# Altium schematic sheet TopLevel.SchDoc
size A4
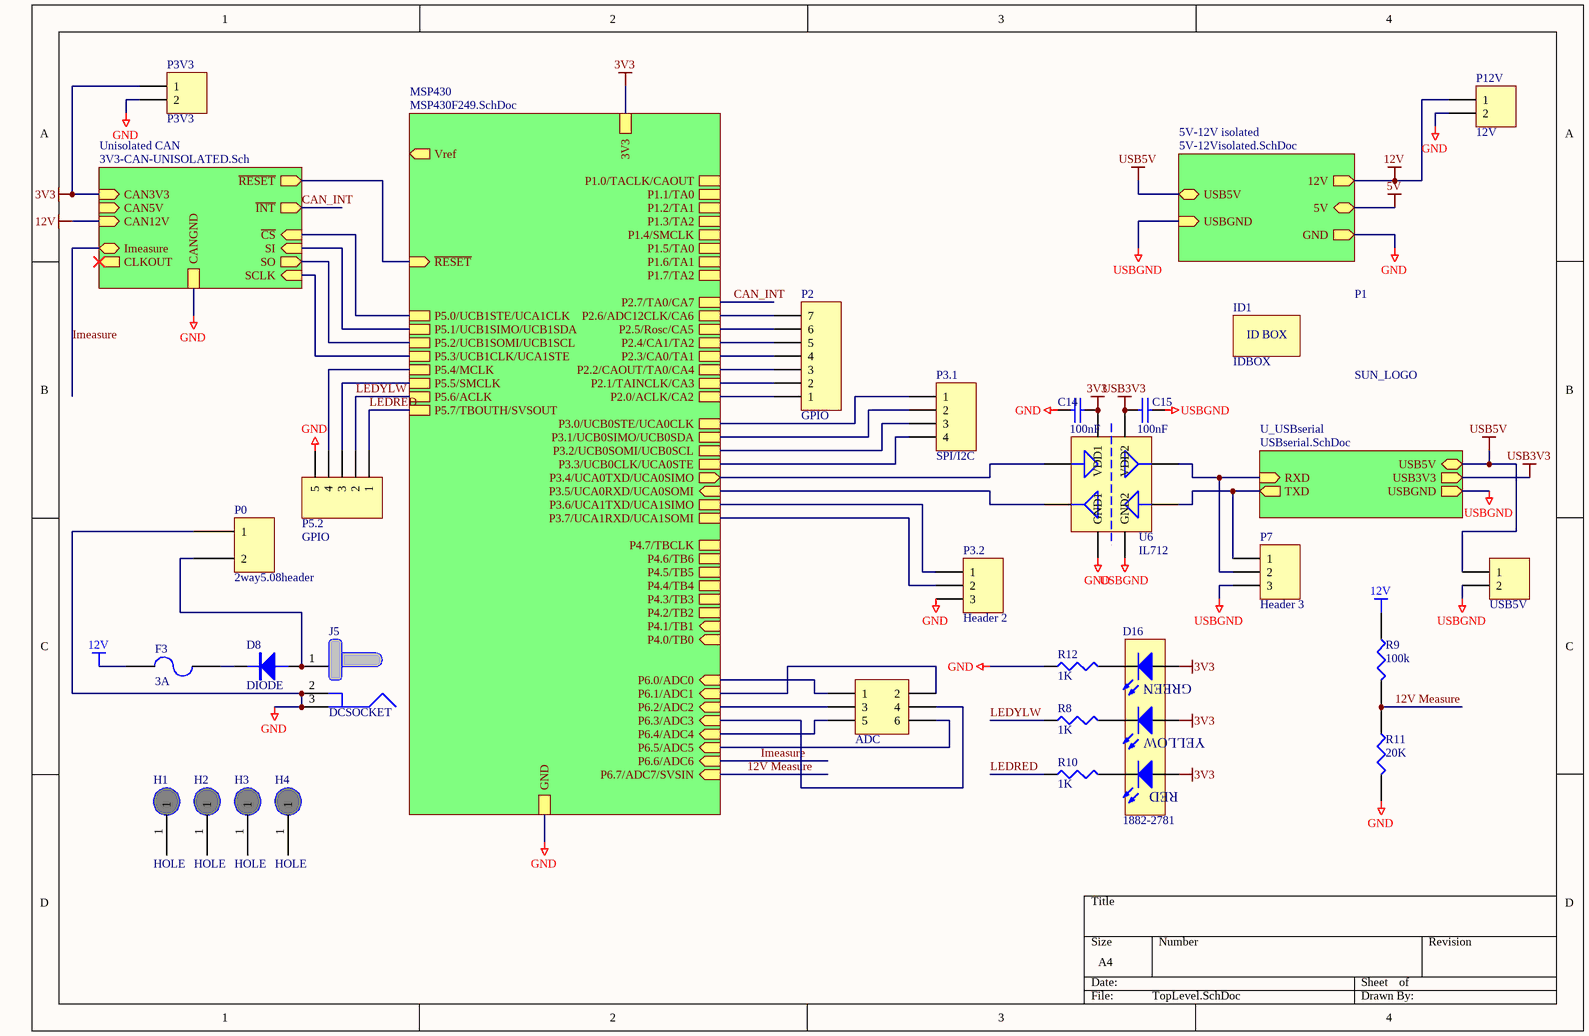
[diagram p0: TopLevel.SchDoc]

## Parts
C14  100nF  [0603]
C15  100nF  [0603]
D8  DIODE  [Diode_1N5820]
D16  1882-2781  [LED_TRILEVEL]
F3  3A  [LITTELFUSE-154]
H1  HOLE  [M2.5]
H2  HOLE  [M2.5]
H3  HOLE  [M2.5]
H4  HOLE  [M2.5]
ID1  IDBOX  [IDBOX]
J5  DCSOCKET  [DCSOCKET_MOD]
P0  2way5.08header  [RightAngle2way]
P1  SUN_LOGO  [SUNSWIFTLOGO]
P2  GPIO  [MHDR1X7]
P3.1  SPI/I2C  [HDR1X4]
P3.2  Header 2  [HDR1X3]
P3V3  P3V3  [HDR1X2]
P5.2  GPIO  [HDR1X5]
P6  ADC  [HDR2X3]
P7  Header 3  [HDR1X3]
P12V  12V  [HDR1X2]
PUSB5V  USB5V  [HDR1X2]
R8  1K  [0603]
R9  100k  [1206]
R10  1K  [0603]
R11  20K  [1206]
R12  1K  [0603]
U6  IL712  [SO8]

## Sub-sheets
5V-12V isolated = 5V-12Visolated.SchDoc: USB5V, USBGND (in), 12V (out), GND (out), 5V
MSP430 = MSP430F249.SchDoc: GND, 3V3, P6.0/ADC0 (in), P6.1/ADC1 (in), P6.2/ADC2 (in), P6.3/ADC3 (in), P6.4/ADC4 (in), P6.5/ADC5 (in), P6.6/ADC6 (in), P6.7/ADC7/SVSIN (in), P1.0/TACLK/CAOUT, P1.1/TA0, P1.2/TA1, P1.3/TA2, P1.4/SMCLK, P1.5/TA0, P1.6/TA1, P1.7/TA2, P2.0/ACLK/CA2, P2.1/TAINCLK/CA3, P2.2/CAOUT/TA0/CA4, P2.3/CA0/TA1, P2.4/CA1/TA2, P2.5/Rosc/CA5, P2.6/ADC12CLK/CA6, P2.7/TA0/CA7, P3.0/UCB0STE/UCA0CLK, P3.1/UCB0SIMO/UCB0SDA, P3.2/UCB0SOMI/UCB0SCL, P3.3/UCB0CLK/UCA0STE, P3.4/UCA0TXD/UCA0SIMO (out), Vref (out), ~{RESET}, P3.5/UCA0RXD/UCA0SOMI (in), P3.6/UCA1TXD/UCA1SIMO, P3.7/UCA1RXD/UCA1SOMI, P4.0/TB0 (in), P4.1/TB1 (in), P4.2/TB2, P4.3/TB3, P4.4/TB4, P4.5/TB5, P4.6/TB6, P4.7/TBCLK, P5.0/UCB1STE/UCA1CLK, P5.1/UCB1SIMO/UCB1SDA, P5.2/UCB1SOMI/UCB1SCL, P5.3/UCB1CLK/UCA1STE, P5.4/MCLK, P5.5/SMCLK, P5.6/ACLK, P5.7/TBOUTH/SVSOUT
U_USBserial = USBserial.SchDoc: TXD (out), RXD (in), USBGND (out), USB3V3 (out), USB5V
Unisolated CAN = 3V3-CAN-UNISOLATED.Sch: SI (in), SO (out), ~{CS} (in), SCLK (in), ~{INT} (out), ~{RESET}, CAN12V (in), CANGND, CAN3V3 (in), CLKOUT (out), CAN5V (in), Imeasure

## Nets
3V3: C14.2 D16.4(A) D16.5(A) D16.6(A) P3V3.1 U6.1(VDD1) ; sheet Unisolated CAN/CAN3V3, sheet MSP430/3V3
5V: sheet 5V-12V isolated/5V
12V: F3.1 P12V.1 R9.1 ; sheet Unisolated CAN/CAN12V, sheet 5V-12V isolated/12V
GND: C14.1 J5.2 J5.3 P0.1 P3.2.3 P3V3.2 P5.2.5 P12V.2 R11.2 R12.1 U6.4(GND1) ; sheet Unisolated CAN/CANGND, sheet MSP430/GND, sheet 5V-12V isolated/GND
USB3V3: C15.1 U6.8(VDD2) ; sheet U_USBserial/USB3V3
USB5V: PUSB5V.1 ; sheet U_USBserial/USB5V, sheet 5V-12V isolated/USB5V
USBGND: C15.2 P7.3 PUSB5V.2 U6.5(GND2) ; sheet U_USBserial/USBGND, sheet 5V-12V isolated/USBGND
12V Measure: R9.2 R11.1 ; sheet MSP430/P6.7/ADC7/SVSIN
CAN_INT: sheet Unisolated CAN/~{INT}, sheet MSP430/P2.7/TA0/CA7
Imeasure: sheet Unisolated CAN/Imeasure, sheet MSP430/P6.6/ADC6
LEDRED: P5.2.1 R10.1 ; sheet MSP430/P5.7/TBOUTH/SVSOUT
LEDYLW: P5.2.2 R8.1 ; sheet MSP430/P5.6/ACLK
NetD8_A: D8.A J5.1 P0.2
NetD8_K: D8.K F3.2
NetD16_1: D16.1(K) R12.2
NetD16_2: D16.2(K) R8.2
NetD16_3: D16.3(K) R10.2
NetP2_1: P2.1 ; sheet MSP430/P2.0/ACLK/CA2
NetP2_2: P2.2 ; sheet MSP430/P2.1/TAINCLK/CA3
NetP2_3: P2.3 ; sheet MSP430/P2.2/CAOUT/TA0/CA4
NetP2_4: P2.4 ; sheet MSP430/P2.3/CA0/TA1
NetP2_5: P2.5 ; sheet MSP430/P2.4/CA1/TA2
NetP2_6: P2.6 ; sheet MSP430/P2.5/Rosc/CA5
NetP2_7: P2.7 ; sheet MSP430/P2.6/ADC12CLK/CA6
NetP3.1_1: P3.1.1 ; sheet MSP430/P3.0/UCB0STE/UCA0CLK
NetP3.1_2: P3.1.2 ; sheet MSP430/P3.1/UCB0SIMO/UCB0SDA
NetP3.1_3: P3.1.3 ; sheet MSP430/P3.2/UCB0SOMI/UCB0SCL
NetP3.1_4: P3.1.4 ; sheet MSP430/P3.3/UCB0CLK/UCA0STE
NetP3.2_1: P3.2.1 ; sheet MSP430/P3.6/UCA1TXD/UCA1SIMO
NetP3.2_2: P3.2.2 ; sheet MSP430/P3.7/UCA1RXD/UCA1SOMI
NetP5.2_3: P5.2.3 ; sheet MSP430/P5.5/SMCLK
NetP5.2_4: P5.2.4 ; sheet MSP430/P5.4/MCLK
NetP6_1: P6.1 ; sheet MSP430/P6.0/ADC0
NetP6_2: P6.2 ; sheet MSP430/P6.1/ADC1
NetP6_3: P6.3 ; sheet MSP430/P6.2/ADC2
NetP6_4: P6.4 ; sheet MSP430/P6.3/ADC3
NetP6_5: P6.5 ; sheet MSP430/P6.4/ADC4
NetP6_6: P6.6 ; sheet MSP430/P6.5/ADC5
NetP7_1: P7.1 U6.6(IN2) ; sheet U_USBserial/TXD
NetP7_2: P7.2 U6.7(OUT1) ; sheet U_USBserial/RXD
NetU6_2: U6.2(IN1) ; sheet MSP430/P3.4/UCA0TXD/UCA0SIMO
NetU6_3: U6.3(OUT2) ; sheet MSP430/P3.5/UCA0RXD/UCA0SOMI
(unnamed): sheet Unisolated CAN/SI, sheet MSP430/P5.1/UCB1SIMO/UCB1SDA
(unnamed): sheet Unisolated CAN/SO, sheet MSP430/P5.2/UCB1SOMI/UCB1SCL
(unnamed): sheet Unisolated CAN/~{CS}, sheet MSP430/P5.0/UCB1STE/UCA1CLK
(unnamed): sheet Unisolated CAN/SCLK, sheet MSP430/P5.3/UCB1CLK/UCA1STE
(unnamed): sheet Unisolated CAN/~{RESET}, sheet MSP430/~{RESET}

Not connected (* = marked no-connect by the designer): H1 1; H2 1; H3 1; H4 1

## Notes on the sheet
- (in symbol IDBOX) ID BOX
- (in symbol LED-TRILEVEL) GREEN; YELLOW; RED

## Library data of the parts
C14 C15 = CAP: Capacitor; Farnell: 753-567; Price: 0.31
D16 = LED-TRILEVEL: Three level LED; Element14 (low stock): 1461596; Element14 Price: 4.56; Digikey: 350-1751-ND; Digikey Price: 2.84
F3 = FUSE2: Fuse; Element14 Price: 5.82 (min 10); Element14: 9943749
P2 = MHDR1X7: Header, 7-Pin; LatestRevisionDate: 17-Jul-2002; LatestRevisionNote: Re-released for DXP Platform.; Publisher: Altium Limited
P3.1 = Header 4: Header, 4-Pin; LatestRevisionDate: 17-Jul-2002; LatestRevisionNote: Re-released for DXP Platform.; Publisher: Altium Limited; Element14 (only one required for entire board): 1248124; Element14 Price (only one required for entire board): 3.48 (16way)
P3.2 P7 = Header 3: Header, 3-Pin; LatestRevisionDate: 17-Jul-2002; LatestRevisionNote: Re-released for DXP Platform.; Publisher: Altium Limited
P3V3 P12V PUSB5V = Header 2: Header, 2-Pin; LatestRevisionDate: 17-Jul-2002; LatestRevisionNote: Re-released for DXP Platform.; Publisher: Altium Limited
  P3V3: Element14: 1248124; Element14 Price: 3.48 (16way)
  P12V PUSB5V: Element14 (only one required for entire board): 1248124; Element14 Price (only one required for entire board): 3.48 (16way)
P5.2 = Header 5: Header, 5-Pin; LatestRevisionDate: 17-Jul-2002; LatestRevisionNote: Re-released for DXP Platform.; Publisher: Altium Limited
P6 = Header 3X2: Header, 3-Pin, Dual row; LatestRevisionDate: 17-Jul-2002; LatestRevisionNote: Re-released for DXP Platform.; Publisher: Altium Limited; Element14: 3418558 (20 way); Element14 Price: 1.10
R8 R10 R12 = RES1: Resistor; Farnell: Stock
R9 R11 = RES1
  R9: Element14: 308-6422; Element14 Price: 2.00
  R11: Element14: 308-6252; Element14 Price: 2.01
U6 = IL712: IL712 Optical Isolator; Element14 (low stock): 9570608; Element14 Price: 9.40; Digikey: 390-1061-5-ND; Digikey Price: 5.86
D8 = DIODE: Element14: 1336553; Element14 Price: 1.60; Digikey: 1N5822-E3/54GICT-ND; Digikey Price: 0.50
J5 = DCSOCKET: Element14: 224960 (10-pack); Element14 Price: 25.89
P0 = 2way5.08header: Element14: 3705171; Element14: 3705535 (plug to suit); Element14 Price: 0.74; Element14 Price: 2.70 (plug to suit)